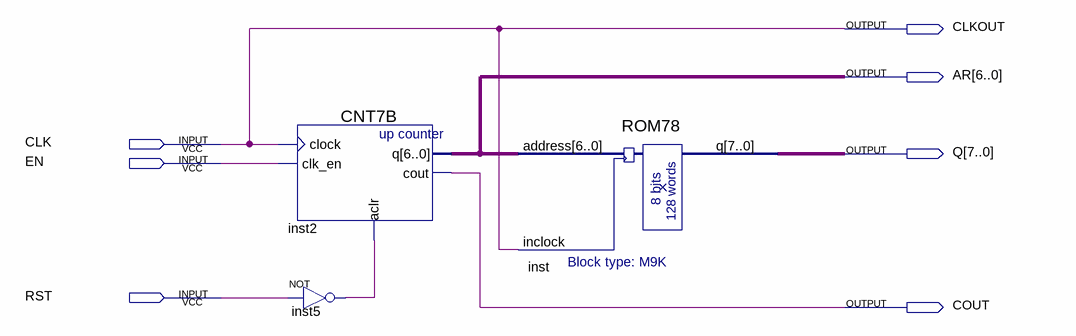
[diagram p0: schematic sheet]
// Quartus schematic SIN_GNT.bdf as structural Verilog: 3 symbols, 7 pins
module SIN_GNT (
  input  CLK,
  input  EN,
  input  RST,
  output CLKOUT,
  output [6:0] AR,
  output [7:0] Q,
  output COUT
);

  wire inst5_out;

  CNT7B inst2 (.clock(CLK), .clk_en(EN), .aclr(inst5_out), .q(AR), .cout(COUT));
  not inst5 (inst5_out, RST);
  ROM78 inst (.address(AR), .inclock(CLK), .q(Q));

  assign CLKOUT = CLK;
endmodule
